# Altium schematic sheet Module_RS485_UART.SchDoc
size 420 x 297 mm; SheetNumber: 1; SheetTotal: 1
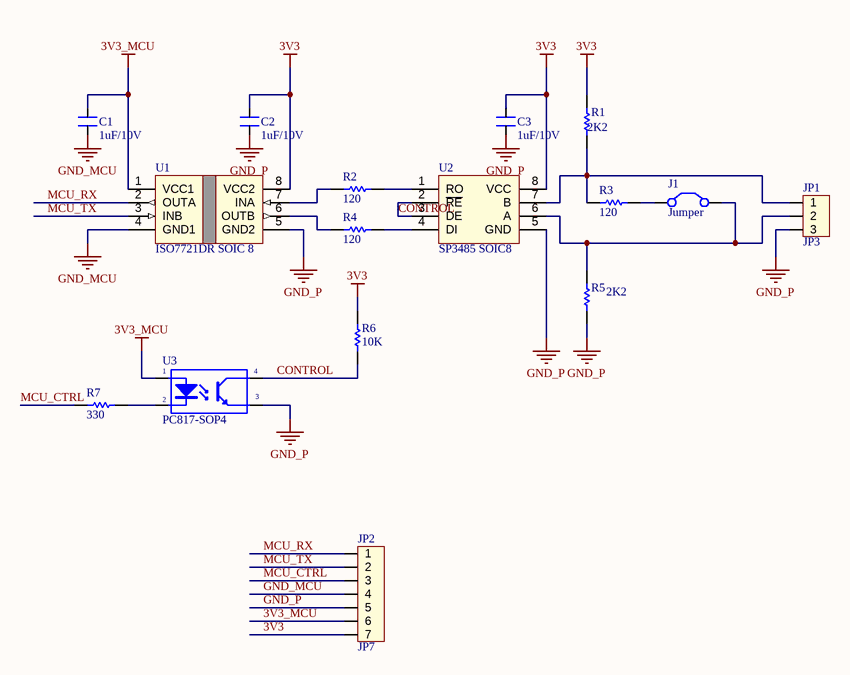
[diagram p0: Module_RS485_UART.SchDoc]

## Parts
C1  1uF/10V  [Cap Ceramic 0603 SMD]
C2  1uF/10V  [Cap Ceramic 0603 SMD]
C3  1uF/10V  [Cap Ceramic 0603 SMD]
J1  Jumper  [Header_2]
JP1  JP3  [2EDGR-5.08-03P]
JP2  JP7  [CON7]
R1  2K2  [Res 0603 SMD_v2]
R2  120  [Res 0603 SMD_v2]
R3  120  [Res 0603 SMD_v2]
R4  120  [Res 0603 SMD_v2]
R5  2K2  [Res 0603 SMD_v2]
R6  10K  [Res 0603 SMD_v2]
R7  330  [Res 0603 SMD_v2]
U1  ISO7721DR SOIC 8  [ISO7721D SOIC-8 10.9mm]
U2  SP3485 SOIC8  [SP3485 SOIC-8 3.9mm]
U3  PC817-SOP4  [TPC817-4SOP]

## Nets
3V3: C2.1 C3.1 JP2.7 R1.2 R6.1 U1.8(VCC2) U2.8(VCC)
3V3_MCU: C1.1 JP2.6 U1.1(VCC1) U3.1(A)
GND_MCU: C1.2 JP2.4 U1.4(GND1)
GND_P: C2.2 C3.2 JP1.3 JP2.5 R5.1 U1.5(GND2) U2.5(GND) U3.3(E)
CONTROL: R6.2 U2.2(~{RE}) U2.3(DE) U3.4(C)
MCU_CTRL: JP2.3 R7.2
MCU_RX: JP2.1 U1.2(OUTA)
MCU_TX: JP2.2 U1.3(INB)
NetJ1_1: J1.1(C1) R3.1
NetJ1_2: J1.2(C2) JP1.2 R5.2 U2.6(A)
NetJP1_1: JP1.1 R1.1 R3.2 U2.7(B)
NetR2_1: R2.1 U2.1(RO)
NetR2_2: R2.2 U1.7(INA)
NetR4_1: R4.1 U2.4(DI)
NetR4_2: R4.2 U1.6(OUTB)
NetR7_1: R7.1 U3.2(K)

## Notes on the sheet
- THIS DOCUMENT AND THE DATA DISCLOSED HEREIN OR
- HEREWITH IS THE PROPERTY OF ALTIUM LIMITED AND MAY
- DWG NO:
- REVISION
- REV:
- DESCRIPTION
- DATE
- APPROVED
- BE FREELY DISTRIBUTED IN WHOLE. NO RIGHTS ARE
- RESERVED OR EXPRESS OR IMPLIED WARANTEE GIVEN.
- ENG:
- APPROVALS
- PROJECT
- DSN:
- CHK:
- REFERENCE DOCUMENTS
- PROJECT REVISION:
- TITLE
- DOCUMENT REVISION:
- DESIGN ITEM:
- BOM:
- FAB DWG:
- PCB DWG:
- ASSY DWG:
- SCALE:
- A3
- SIZE
- CAGE CODE
- FILE NAME
- DWG NO.
- SHEET
- OF
- REV

## Library data of the parts
C1-C3 = Cap Ceramic SMD: Buy Link: https://www.thegioiic.com/products/tu-1uf-50v-0805
J1 = Jumper: Jumper Wire; Published: 24-Mar-1999; LatestRevisionDate: 17-Jul-2002; LatestRevisionNote: Re-released for DXP Platform.; PackageReference: RAD-0.2; Publisher: Altium Limited; PackageDescription: Radial Cap, Thru-Hole; 2 Leads; 0.2 in Pin Spacing
JP1 = Con3: Connector 3; Value: Connector 3
JP2 = Con7: Connector 7; Value: Connector 7
R1-R7 = 249K/R0805/1%_2: RES SMD 249K OHM 1% 1/10W 0805; Manufacturer: Yageo; Manufacturer Part Number: RC0603FR-07249KL; Power (Watts): 0.1W, 1/10W; Temperature Coefficient: ±100ppm/°C; Supplier 1: Digi-Key; RoHS: RoHS Compliant; Category: Resistors; Stock 1: 370515; Pricing 1: 1=0.1, 10=0.015, 100=0.006, 1000=0.00268, 2500=0.00233 (USD); Packaging: Cut Tape (CT); Part Status: Active; Tolerance: ±1%; Composition: Thick Film; Features: Moisture Resistant; Operating Temperature: -55°C ~ 155°C; Package / Case: 0603 (1608 Metric); Supplier Device Package: 0603; Size / Dimension: 0.063" L x 0.032" W (1.60mm x 0.80mm); Height - Seated (Max): 0.022" (0.55mm); Failure Rate: -; ComponentLink1URL: http://www.yageo.com/documents/recent/PYu-RC_Group_51_RoHS_L_8.pdf; ComponentLink1Description: http://www.yageo.com/documents/recent/PYu-RC_Group_51_RoHS_L_8.pdf
U1 = ISO7721DR SOIC 8: ISO772x High-Speed, Robust EMC, Reinforced Dual-Channel Digital Isolators
U3 = PC817: Optoisolator Transistor Output 5000Vrms 1 Channel 4-SOP; Digikey: TPC817S1BRAGCT-ND; BuyVN: https://banlinhkien.vn/goods-1134-pc817-el817-sop4-opto.html